# Altium schematic sheet EBIKeyAV.SchDoc
size 220 x 165 mm
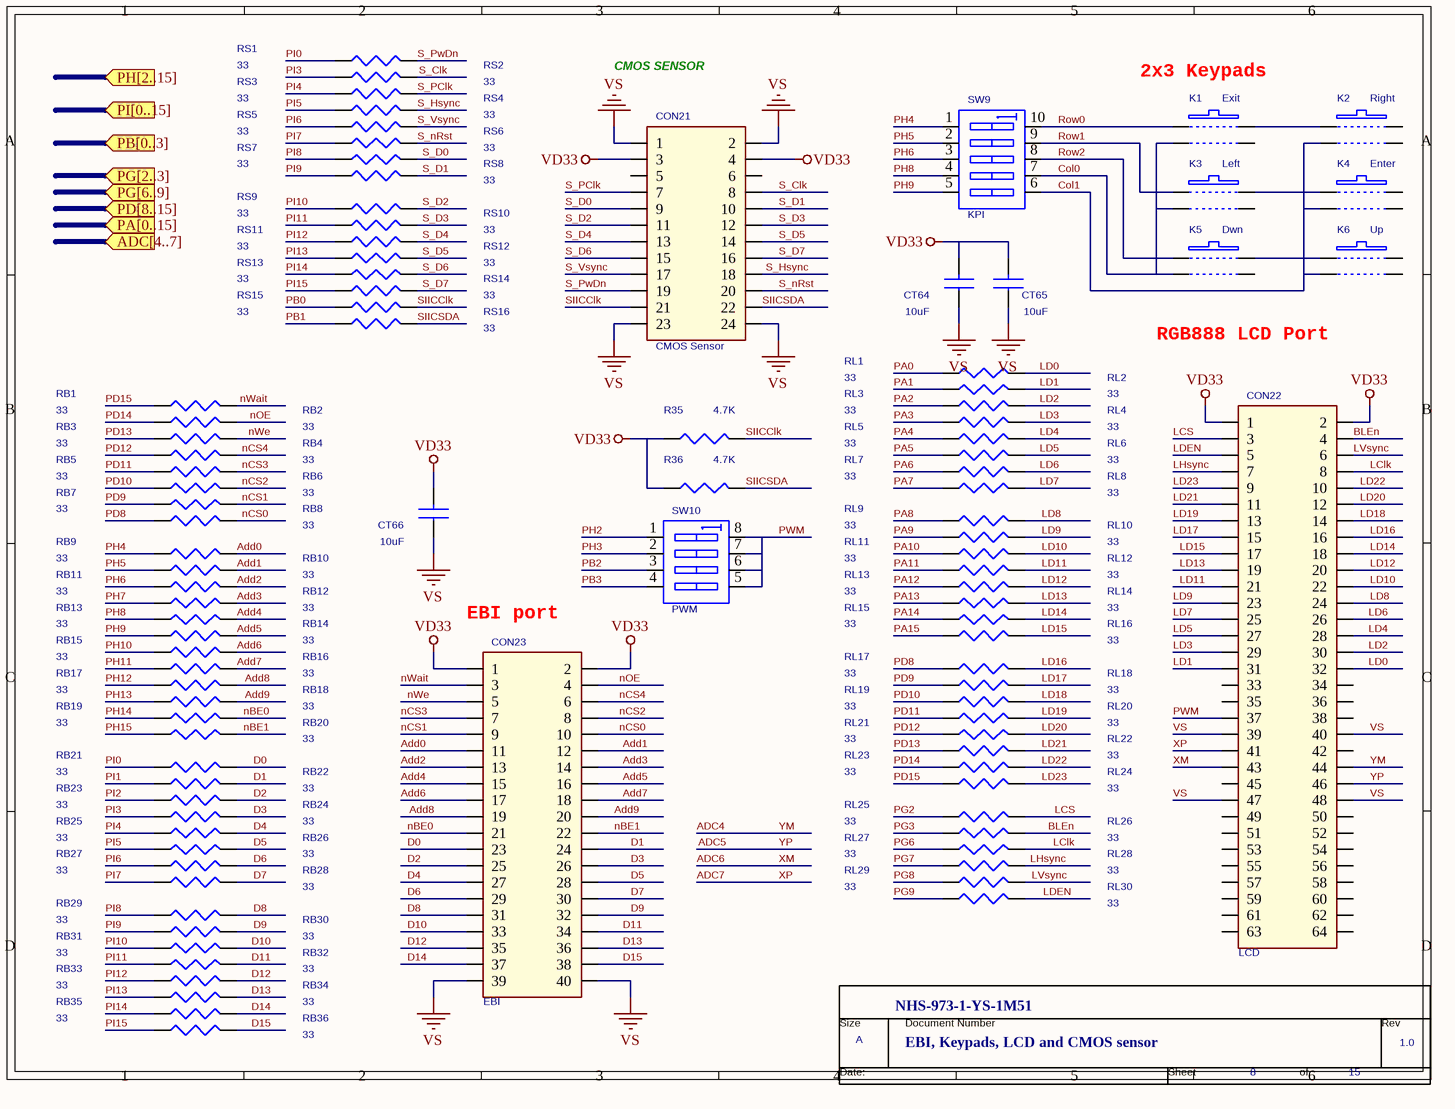
[diagram p0: EBIKeyAV.SchDoc]

## Parts
*  RevCode: 1.0  Page Size: A  Page Number: 8  Page Count: 15  Doc: EBI, Keypads, LCD and CMOS sensor  OrgName: NHS-973-1-YS-1M51  (hidden comment: TitleBlock0N)  (graphical)
CON21  CMOS Sensor  [Header_2x12_2.54mm]
CON22  LCD  [M_DIN_32X2/2.54A]
CON23  EBI  [Header_2x20_2.54mm]
CT64  10uF  [C0603]
CT65  10uF  [C0603]
CT66  10uF  [C0603]
K1  Exit  [STS-B5]
K2  Right  [STS-B5]
K3  Left  [STS-B5]
K4  Enter  [STS-B5]
K5  Dwn  [STS-B5]
K6  Up  [STS-B5]
R35  4.7K  [R0603]
R36  4.7K  [R0603]
RB1  33  [R0603]
RB2  33  [R0603]
RB3  33  [R0603]
RB4  33  [R0603]
RB5  33  [R0603]
RB6  33  [R0603]
RB7  33  [R0603]
RB8  33  [R0603]
RB9  33  [R0603]
RB10  33  [R0603]
RB11  33  [R0603]
RB12  33  [R0603]
RB13  33  [R0603]
RB14  33  [R0603]
RB15  33  [R0603]
RB16  33  [R0603]
RB17  33  [R0603]
RB18  33  [R0603]
RB19  33  [R0603]
RB20  33  [R0603]
RB21  33  [R0603]
RB22  33  [R0603]
RB23  33  [R0603]
RB24  33  [R0603]
RB25  33  [R0603]
RB26  33  [R0603]
RB27  33  [R0603]
RB28  33  [R0603]
RB29  33  [R0603]
RB30  33  [R0603]
RB31  33  [R0603]
RB32  33  [R0603]
RB33  33  [R0603]
RB34  33  [R0603]
RB35  33  [R0603]
RB36  33  [R0603]
RL1  33  [R0603]
RL2  33  [R0603]
RL3  33  [R0603]
RL4  33  [R0603]
RL5  33  [R0603]
RL6  33  [R0603]
RL7  33  [R0603]
RL8  33  [R0603]
RL9  33  [R0603]
RL10  33  [R0603]
RL11  33  [R0603]
RL12  33  [R0603]
RL13  33  [R0603]
RL14  33  [R0603]
RL15  33  [R0603]
RL16  33  [R0603]
RL17  33  [R0603]
RL18  33  [R0603]
RL19  33  [R0603]
RL20  33  [R0603]
RL21  33  [R0603]
RL22  33  [R0603]
RL23  33  [R0603]
RL24  33  [R0603]
RL25  33  [R0603]
RL26  33  [R0603]
RL27  33  [R0603]
RL28  33  [R0603]
RL29  33  [R0603]
RL30  33  [R0603]
RS1  33  [R0603]
RS2  33  [R0603]
RS3  33  [R0603]
RS4  33  [R0603]
RS5  33  [R0603]
RS6  33  [R0603]
RS7  33  [R0603]
RS8  33  [R0603]
RS9  33  [R0603]
RS10  33  [R0603]
RS11  33  [R0603]
RS12  33  [R0603]
RS13  33  [R0603]
RS14  33  [R0603]
RS15  33  [R0603]
RS16  33  [R0603]
SW9  KPI  [DIPSWx5_2.54mm]
SW10  PWM  [DIPSWx4_2.54mm]

## Ports
ADC[4..7] (in), PA[0..15] (in), PB[0..3] (in), PD[8..15] (in), PG[2..3] (in), PG[6..9] (in), PH[2..15] (in), PI[0..15] (in)

## Nets
VD33: CON21.3 CON21.4 CON22.1 CON22.2 CON23.1 CON23.2 CT64.2 CT65.2 CT66.2 R35.1 R36.1
VS: CON21.1 CON21.2 CON21.23 CON21.24 CON22.39 CON22.40 CON22.47 CON22.48 CON23.39 CON23.40 CT64.1 CT65.1 CT66.1
ADC4: CON22.44  [also labelled YM]
ADC5: CON22.46  [also labelled YP]
ADC6: CON22.43  [also labelled XM]
ADC7: CON22.41  [also labelled XP]
Add0: CON23.11 RB9.2
Add1: CON23.12 RB10.2
Add2: CON23.13 RB11.2
Add3: CON23.14 RB12.2
Add4: CON23.15 RB13.2
Add5: CON23.16 RB14.2
Add6: CON23.17 RB15.2
Add7: CON23.18 RB16.2
Add8: CON23.19 RB17.2
Add9: CON23.20 RB18.2
BLEn: CON22.4 RL26.2
Col0: K1.1 K3.2 K5.1 SW9.7(B4)
Col1: K2.1 K4.1 K6.1 SW9.6(B5)
D0: CON23.23 RB21.2
D1: CON23.24 RB22.2
D2: CON23.25 RB23.2
D3: CON23.26 RB24.2
D4: CON23.27 RB25.2
D5: CON23.28 RB26.2
D6: CON23.29 RB27.2
D7: CON23.30 RB28.2
D8: CON23.31 RB29.2
D9: CON23.32 RB30.2
D10: CON23.33 RB31.2
D11: CON23.34 RB32.2
D12: CON23.35 RB33.2
D13: CON23.36 RB34.2
D14: CON23.37 RB35.2
D15: CON23.38 RB36.2
LClk: CON22.8 RL27.2
LCS: CON22.3 RL25.2
LD0: CON22.32 RL1.2
LD1: CON22.31 RL2.2
LD2: CON22.30 RL3.2
LD3: CON22.29 RL4.2
LD4: CON22.28 RL5.2
LD5: CON22.27 RL6.2
LD6: CON22.26 RL7.2
LD7: CON22.25 RL8.2
LD8: CON22.24 RL9.2
LD9: CON22.23 RL10.2
LD10: CON22.22 RL11.2
LD11: CON22.21 RL12.2
LD12: CON22.20 RL13.2
LD13: CON22.19 RL14.2
LD14: CON22.18 RL15.2
LD15: CON22.17 RL16.2
LD16: CON22.16 RL17.2
LD17: CON22.15 RL18.2
LD18: CON22.14 RL19.2
LD19: CON22.13 RL20.2
LD20: CON22.12 RL21.2
LD21: CON22.11 RL22.2
LD22: CON22.10 RL23.2
LD23: CON22.9 RL24.2
LDEN: CON22.5 RL30.2
LHsync: CON22.7 RL28.2
LVsync: CON22.6 RL29.2
nBE0: CON23.21 RB19.2
nBE1: CON23.22 RB20.2
nCS0: CON23.10 RB8.2
nCS1: CON23.9 RB7.2
nCS2: CON23.8 RB6.2
nCS3: CON23.7 RB5.2
nCS4: CON23.6 RB4.2
nOE: CON23.4 RB2.2
nWait: CON23.3 RB1.2
nWe: CON23.5 RB3.2
PA0: RL1.1
PA1: RL2.1
PA2: RL3.1
PA3: RL4.1
PA4: RL5.1
PA5: RL6.1
PA6: RL7.1
PA7: RL8.1
PA8: RL9.1
PA9: RL10.1
PA10: RL11.1
PA11: RL12.1
PA12: RL13.1
PA13: RL14.1
PA14: RL15.1
PA15: RL16.1
PB0: RS15.1
PB1: RS16.1
PB2: SW10.3(A3)
PB3: SW10.4(A4)
PD8: RB8.1 RL17.1
PD9: RB7.1 RL18.1
PD10: RB6.1 RL19.1
PD11: RB5.1 RL20.1
PD12: RB4.1 RL21.1
PD13: RB3.1 RL22.1
PD14: RB2.1 RL23.1
PD15: RB1.1 RL24.1
PG2: RL25.1
PG3: RL26.1
PG6: RL27.1
PG7: RL28.1
PG8: RL29.1
PG9: RL30.1
PH2: SW10.1(A1)
PH3: SW10.2(A2)
PH4: RB9.1 SW9.1(A1)
PH5: RB10.1 SW9.2(A2)
PH6: RB11.1 SW9.3(A3)
PH7: RB12.1
PH8: RB13.1 SW9.4(A4)
PH9: RB14.1 SW9.5(A5)
PH10: RB15.1
PH11: RB16.1
PH12: RB17.1
PH13: RB18.1
PH14: RB19.1
PH15: RB20.1
PI0: RB21.1 RS1.1
PI1: RB22.1
PI2: RB23.1
PI3: RB24.1 RS2.1
PI4: RB25.1 RS3.1
PI5: RB26.1 RS4.1
PI6: RB27.1 RS5.1
PI7: RB28.1 RS6.1
PI8: RB29.1 RS7.1
PI9: RB30.1 RS8.1
PI10: RB31.1 RS9.1
PI11: RB32.1 RS10.1
PI12: RB33.1 RS11.1
PI13: RB34.1 RS12.1
PI14: RB35.1 RS13.1
PI15: RB36.1 RS14.1
PWM: CON22.37 SW10.5(B4) SW10.6(B3) SW10.7(B2) SW10.8(B1)
Row0: K1.3 SW9.10(B1)
Row1: K3.4 SW9.9(B2)
Row2: K5.3 SW9.8(B3)
S_Clk: CON21.8 RS2.2
S_D0: CON21.9 RS7.2
S_D1: CON21.10 RS8.2
S_D2: CON21.11 RS9.2
S_D3: CON21.12 RS10.2
S_D4: CON21.13 RS11.2
S_D5: CON21.14 RS12.2
S_D6: CON21.15 RS13.2
S_D7: CON21.16 RS14.2
S_Hsync: CON21.18 RS4.2
S_nRst: CON21.20 RS6.2
S_PClk: CON21.7 RS3.2
S_PwDn: CON21.19 RS1.2
S_Vsync: CON21.17 RS5.2
SIICClk: CON21.21 R35.2 RS15.2
SIICSDA: CON21.22 R36.2 RS16.2
NetK1_4: K1.4 K2.3
NetK3_3: K3.3 K4.3
NetK5_4: K5.4 K6.3

Not connected (* = marked no-connect by the designer): CON21 5 6; CON22 33 34 35 36 38 42 45 49 50 51 52 53 54 55 56 57 58 59 60 61 62 63 64; K1 2; K2 2 4; K3 1; K4 2 4; K5 2; K6 2 4

## Notes on the sheet
- CMOS SENSOR
- (near K1) 2x3 Keypads
- RGB888 LCD Port
- (near CON23) EBI port
- (in symbol TitleBlock0N) Size; Document Number; Rev; Date:; Sheet; of

## Library data of the parts
CON21 = CON24A
CON22 = CON40A_0
CON23 = CON40A
CT64-CT66 = CAP NP
K1-K6 = SW-S
R35 R36 RB1-RB36 RL1-RL30 RS1-RS16 = R
SW9 = SW DIP-5_0
SW10 = SW DIP-4_0
* = TitleBlock0N: Page Create Date: April 25, 1995